# Altium project FPGA_SHIELD_MARK1.PrjPcb (part 1 of 2)
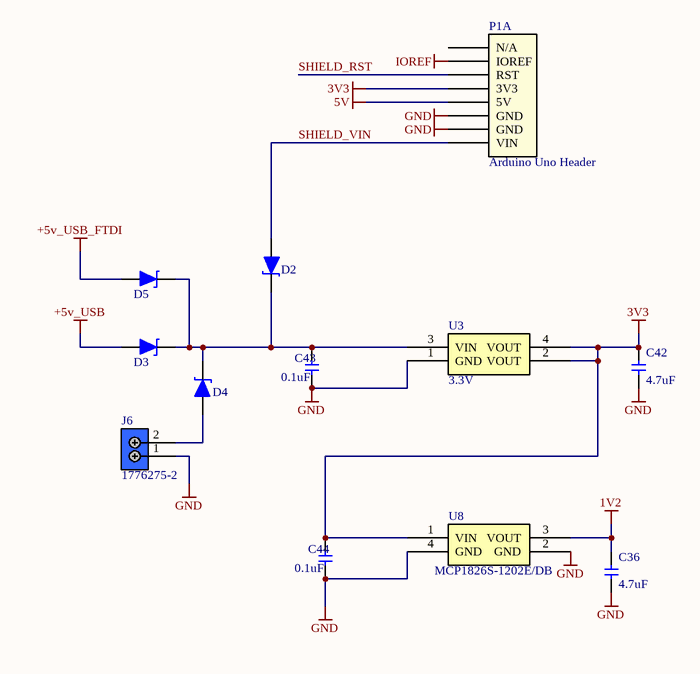
[diagram p0: POWER_SUPPLY.SchDoc]
Engineer: M. Jones; PCB_TITLE: FPGA Mark 1; PCB_VERSION: a
5 sheets, 144 parts. Net scope: flat (ports and power ports of the same name join across sheets).
Board file: FPGA_SHIELD_MARK1_Single_Side.PcbDoc
Sheets:
  POWER_SUPPLY.SchDoc
  LOGIC_FPGA.SchDoc
  FPGA_POWER_AND_CONFIGURATION.SchDoc
  DIGITAL_IO.SchDoc
  LOGIC_MCU.SchDoc

## Sheet POWER_SUPPLY.SchDoc
size B; Author: Michael Jones; Engineer: Eli Hughes; Address1: 1652 W 820 N; Address2: Provo; Address3: UT  84601; Address4: 801-379-0118; DocumentNumber: 2; Revision: A3; SheetNumber: 2; SheetTotal: 6

### Parts
(Parts that share a designator on the sheet are numbered #1, #2 ... from top to bottom, then left to right.)
C36  4.7uF  [C0603]
C42  4.7uF  [C0603]
C43#1  0.1uF  [C0603]
C44#1  0.1uF  [C0603]
D2  RB161M-20TR  [SOD-123]  (value not drawn)
D3#1  RB161M-20TR  [SOD-123]  (value not drawn)
D4  RB161M-20TR  [SOD-123]  (value not drawn)
D5  RB161M-20TR  [SOD-123]  (value not drawn)
J6#1  1776275-2  [1776275-2]
P1  Arduino Uno Header  [Arduino Shield]  (part A of 4)
U3#1  3.3V  [SOT223]
U8#1  MCP1826S-1202E/DB  [SOT223]

### Nets
1V2: C36.2 U8#1.3(VOUT)
3V3: C42.2 C44#1.2 P1.A2(3V3) U3#1.2(VOUT) U3#1.4(VOUT) U8#1.1(VIN)
5V: P1.A3(5V)
+5v_USB: D3#1.2(A)
+5v_USB_FTDI: D5.2(A)
GND: C36.1 C42.1 C43#1.1 C44#1.1 J6#1.1 P1.A4(GND) P1.A5(GND) U3#1.1(GND) U8#1.2(GND) U8#1.4(GND)
IOREF: P1.A0(IOREF)
SHIELD_RST: P1.A1(RST)
SHIELD_VIN: D2.2(A) P1.A6(VIN)
NetC43#1_2: C43#1.2 D2.1(C) D3#1.1(C) D4.1(C) D5.1(C) U3#1.3(VIN)
NetD4_2: D4.2(A) J6#1.2

Not connected (* = marked no-connect by the designer): P1 A-1(N/A)

### Notes on the sheet
- 2
- Wavenumber
- pl
- -1
- Rev:
- Technologies
- Sheet
- of

### Library data of the parts
C36 C42 = GRM188R60J475KE19D: CAP CER 4.7UF 6.3V X5R 0603; Manufacturer: Murata Electronics North America; Capacitance: 4.7µF; Tolerance: ±10%; Supplier 1: Digi-Key; Supplier Part Number 1: 490-3297-1-ND; Manufacturer Part Number: GRM188R60J475KE19D; RoHS: RoHS Compliant; Category: Capacitors; Stock 1: 714091; Pricing 1: 10=0.214, 50=0.148, 100=0.1142, 250=0.08204, 500=0.0585, 1000=0.04281 (USD); Voltage - Rated: 6.3V; Temperature Coefficient: X5R; Mounting Type: Surface Mount, MLCC; Operating Temperature: -55°C ~ 85°C; Applications: General Purpose; Ratings: -; Package / Case: 0603 (1608 Metric); Size / Dimension: 0.063" L x 0.031" W (1.60mm x 0.80mm); Height: -; Thickness: 0.035" (0.90mm); Lead Spacing: -; Features: -; Packaging: Cut Tape (CT); Lead Style: -; ComponentLink1URL: http://search.murata.co.jp/Ceramy/image/img/PDF/ENG/GRM188R60J475KE19.pdf; ComponentLink1Description: http://search.murata.co.jp/Ceramy/image/img/PDF/ENG/GRM188R60J475KE19.pdf; Value: 4.7uF
C43#1 C44#1 = GRM188R71H104KA93D: CAP CER .1UF 50V 10% X7R 0603; Manufacturer: Murata Electronics North America; Capacitance: 0.1µF; Value: 0.1uF; Supplier 1: Digi-Key; Supplier Part Number 1: 490-1519-1-ND; Manufacturer Part Number: GRM188R71H104KA93D; RoHS: RoHS Compliant; Category: Capacitors; Stock 1: 6315460; Pricing 1: 10=0.037, 100=0.0221, 500=0.01276, 1000=0.00884 (USD); Voltage - Rated: 50V; Tolerance: ±10%; Temperature Coefficient: X7R; Mounting Type: Surface Mount, MLCC; Operating Temperature: -55°C ~ 125°C; Features: -; Applications: General Purpose; Ratings: -; Package / Case: 0603 (1608 Metric); Size / Dimension: 0.063" L x 0.031" W (1.60mm x 0.80mm); Lead Spacing: -; Thickness: 0.80mm; Packaging: Cut Tape (CT); Lead Style: -; ComponentLink1URL: http://search.murata.co.jp/Ceramy/image/img/PDF/ENG/GRM188R71H104KA93.pdf; ComponentLink1Description: http://search.murata.co.jp/Ceramy/image/img/PDF/ENG/GRM188R71H104KA93.pdf
D2 D3#1 D4 D5 = RB161M-20TR: DIODE SCHOTTKY 25V 1A SOD123; Source Part Number: RB161M-20CT-ND; Manufacturer: Diodes Inc; Manufacturer Part Number: Rohm Semiconductor; Description: DIODE SCHOTTKY 20V 1A SOD123; Voltage - Forward (Vf) (Max) @ If: 350mV @ 1A; Voltage - DC Reverse (Vr) (Max): 20V; Current - Reverse Leakage @ Vr: 700µA @ 20V; Speed: Fast Recovery =< 500ns, > 200mA (Io); Source: Digikey; Value: RB161M-20TR; Supplier 1: Digi-Key; RoHS: RoHS Compliant; Category: Discrete Semiconductor Products; Stock 1: 29589; Pricing 1: 1=0.58, 25=0.4044, 100=0.3465, 250=0.29924, 500=0.25726, 1000=0.1995 (USD); Current - Average Rectified (Io): 1A; Diode Type: Schottky; Reverse Recovery Time (trr): -; Capacitance @ Vr, F: -; Mounting Type: Surface Mount; Package / Case: SOD-123F; Supplier Device Package: PMDU; Packaging: Cut Tape (CT); ComponentLink1URL: http://www.rohm.com/products/databook/di/pdf/rb161m-20.pdf; ComponentLink1Description: http://www.rohm.com/products/databook/di/pdf/rb161m-20.pdf; Supplier Part Number 1: RB161M-20CT-ND
J6#1 = 1776275-2: TERM BLOCK 2POS SIDE ENT 3.5MM; Manufacturer: TE Connectivity; Number of Levels: 1; Positions Per Level: 2; Pitch: 0.138" (3.50mm); Mating Orientation: Horizontal with Board; Current: 7A; Voltage: 250V; Wire Gauge: 18-26 AWG; Wire Termination: Screw - Leaf Spring, Wire Guard; Clamp Material - Plating: Steel, Stainless; Screw Material - Plating: Steel, Galvanized - Chromate Plated; Torque - Screw: 0.28 Nm (2.5 Lb-In); Screw Thread: M2.6; Supplier 1: Digi-Key; Supplier Part Number 1: A98036-ND; Manufacturer Part Number: 1776275-2; RoHS: RoHS Compliant; Category: Connectors, Interconnects; Stock 1: 46916; Pricing 1: 1=0.44, 10=0.417, 25=0.3572, 50=0.3036, 100=0.2917, 250=0.26196, 500=0.25004, 1000=0.20837, 2500=0.19051 (USD); Mounting Type: Through Hole; Features: Interlocking (Side); Color: Blue; Packaging: Bulk; Operating Temperature: -55°C ~ 105°C; Housing Material: Polyamide (PA66), Nylon 6/6; Contact Material - Plating: Brass - Copper Tin Plated; ComponentLink1URL: http://documents.tycoelectronics.com/commerce/DocumentDelivery/DDEController?Action=srchrtrv&DocNm=1776275&DocType=CD&DocLang=EN; ComponentLink1Description: http://documents.tycoelectronics.com/commerce/DocumentDelivery/DDEController?Action=srchrtrv&DocNm=1776275&DocType=CD&DocLang=EN; Value: 1776275-2
P1 = Arduino Shield: Arduino Duem Header
U3#1 = LD1117S33CTR: IC REG LDO 3.3V 950MA SOT-223; Manufacturer: STMicroelectronics; Regulator Topology: Positive Fixed; Voltage - Input: Up to 15V; Voltage - Dropout (Typical): 1.1V @ 800mA; Number of Regulators: 1; Supplier 1: Digi-Key; Supplier Part Number 1: 497-1241-1-ND; Manufacturer Part Number: LD1117S33CTR; RoHS: RoHS Compliant; Category: Integrated Circuits (ICs); Stock 1: 20460; Pricing 1: 1=0.54, 10=0.436, 100=0.3267, 250=0.28216, 500=0.24256, 1000=0.1881 (USD); Voltage - Output: 3.3V; Current - Output: 950mA; Current - Limit (Min): -; Operating Temperature: -40°C ~ 125°C; Mounting Type: Surface Mount; Package / Case: TO-261-4, TO-261AA; Supplier Device Package: SOT-223; Packaging: Cut Tape (CT); ComponentLink1URL: http://www.st.com/internet/com/TECHNICAL_RESOURCES/TECHNICAL_LITERATURE/DATASHEET/CD00000544.pdf; ComponentLink1Description: http://www.st.com/internet/com/TECHNICAL_RESOURCES/TECHNICAL_LITERATURE/DATASHEET/CD00000544.pdf; value: LD1117S33CTR
U8#1 = MCP1826S-1202E/DB: IC LDO REG 1A 1.2V SOT223-3; Manufacturer: Microchip Technology; Regulator Topology: Positive Fixed; Voltage - Input: Up to 6V; Voltage - Dropout (Typical): 0.25V @ 1A; Number of Regulators: 1; Current - Output: 1A (Min); Value: MCP1826S-1202E/DB; Supplier 1: Digi-Key; Supplier Part Number 1: MCP1826S-1202E/DB-ND; Manufacturer Part Number: MCP1826S-1202E/DB; RoHS: RoHS Compliant; Category: Integrated Circuits (ICs); Stock 1: 2041; Pricing 1: 1=0.74, 10=0.68, 25=0.57, 100=0.52 (USD); Voltage - Output: 1.2V; Current - Limit (Min): -; Operating Temperature: -40°C ~ 125°C; Mounting Type: Surface Mount; Package / Case: TO-261-4, TO-261AA; Supplier Device Package: SOT-223-3; Packaging: Tube; ComponentLink1URL: http://ww1.microchip.com/downloads/en/DeviceDoc/22057a.pdf; ComponentLink1Description: http://ww1.microchip.com/downloads/en/DeviceDoc/22057a.pdf

## Sheet LOGIC_FPGA.SchDoc: FPGA Logic
size B; Author: Michael Jones; Engineer: Michael Jones; Organization: Group VIII Technology; Address1: 1652 W 820 N; Address2: Provo; Address3: UT  84601; Address4: 801-379-0118; DocumentNumber: 3; Revision: A3; SheetNumber: 2; SheetTotal: 7
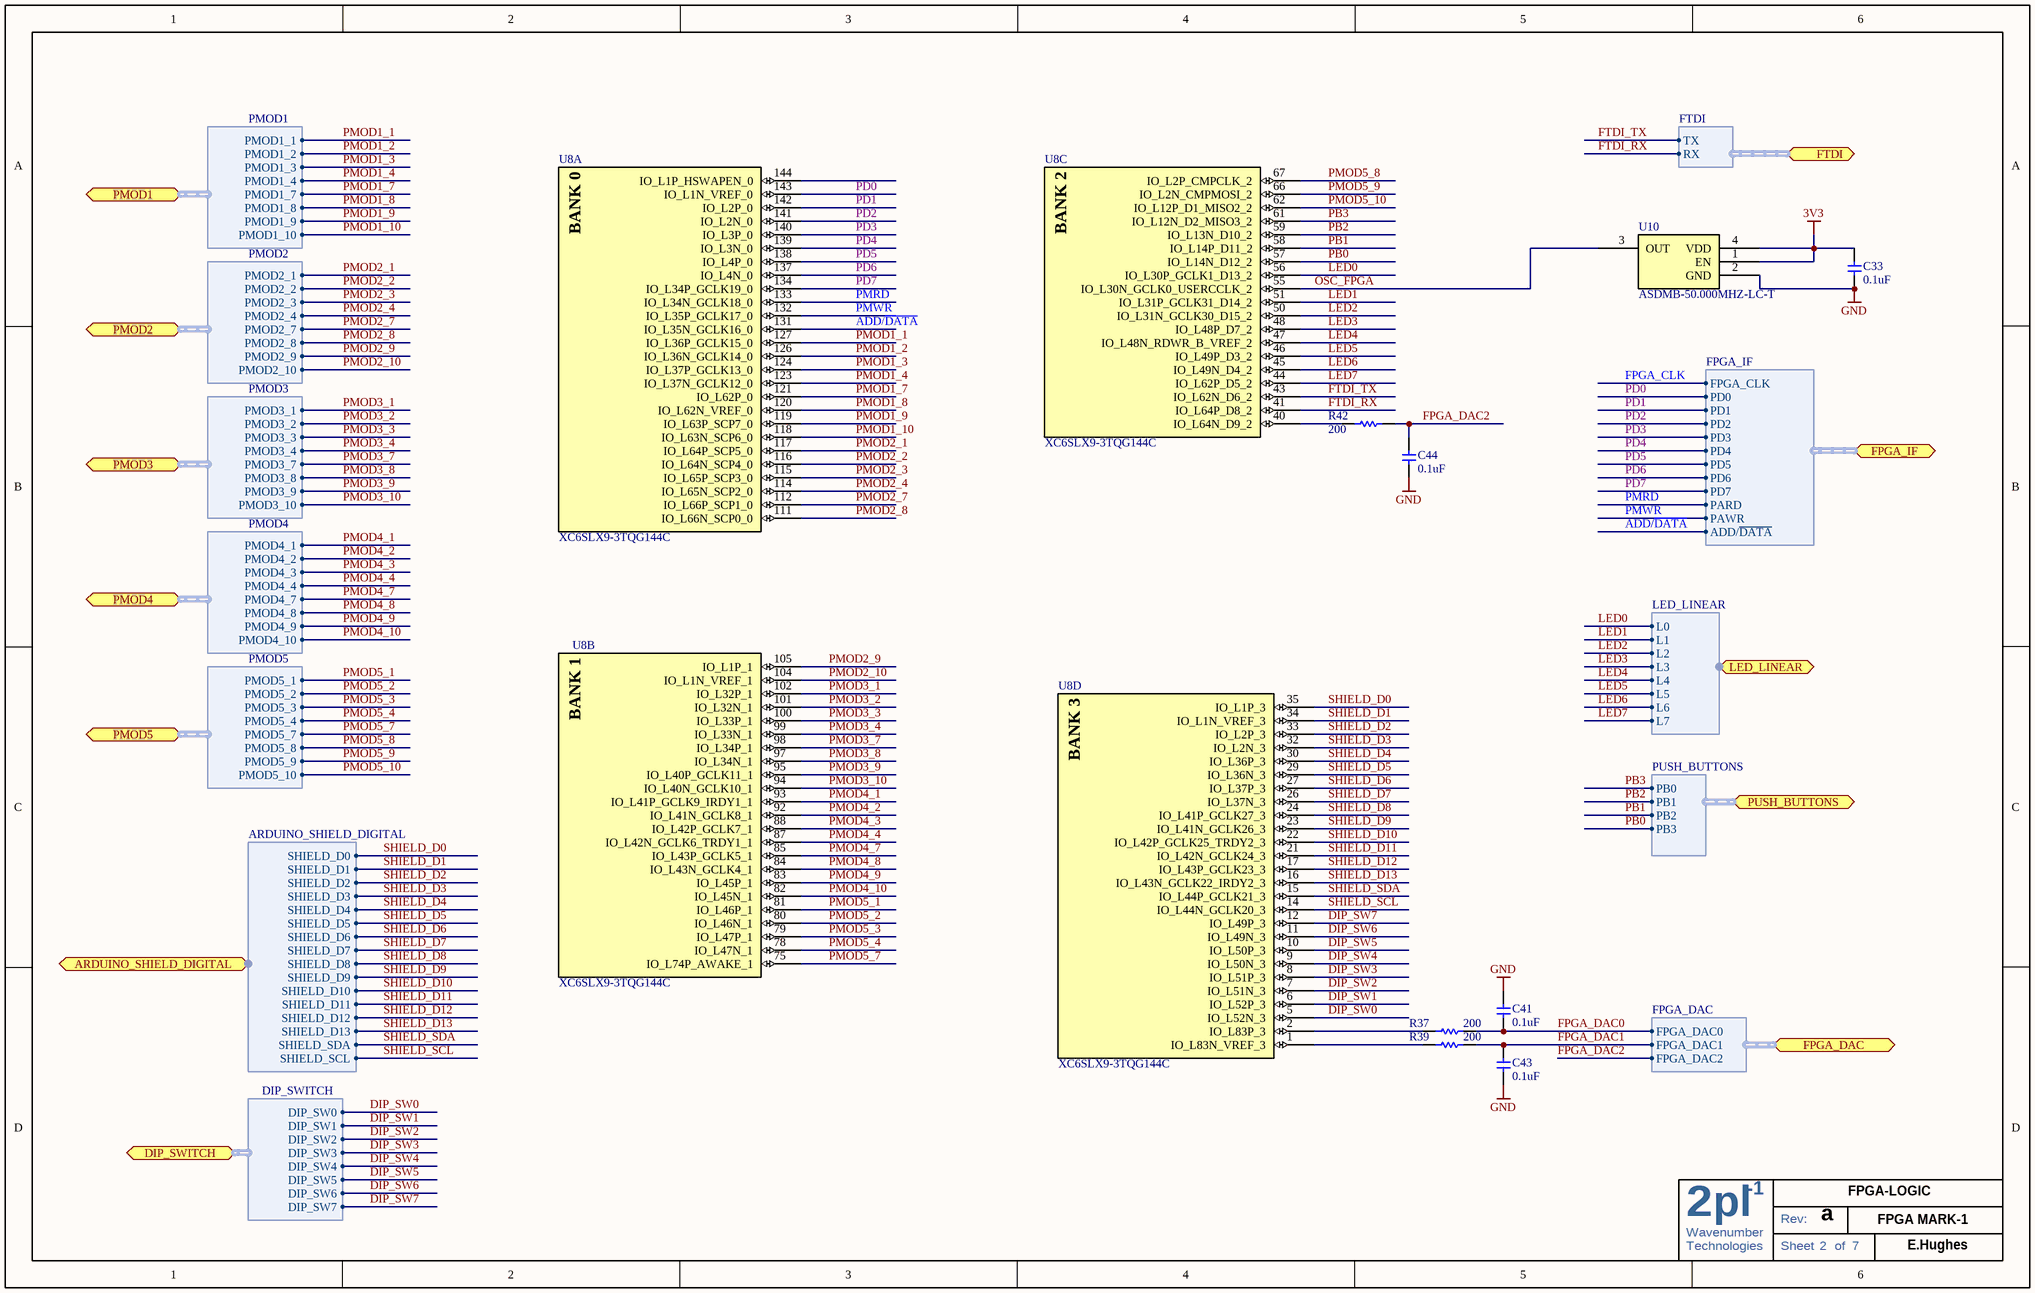
[diagram p1: LOGIC_FPGA.SchDoc]

### Parts
(Parts that share a designator on the sheet are numbered #1, #2 ... from top to bottom, then left to right.)
C33  0.1uF  [C0603]
C41  0.1uF  [C0603]
C43#2  0.1uF  [C0603]
C44#2  0.1uF  [C0603]
R37  200  [R0603]
R39  200  [R0603]
R42  200  [R0603]
U8#2  XC6SLX9-3TQG144C  [TQ144_L]  (parts A,B,C,D of 7)
U10  ASDMB-50.000MHZ-LC-T  [ASDMB - osc]

### Ports
ARDUINO_SHIELD_DIGITAL (harness ARDUINO_SHIELD_DIGITAL), DIP_SWITCH (harness DIP_SWITCH), FPGA_DAC (harness FPGA_DAC), FPGA_IF (harness FPGA_IF), FTDI (harness FTDI), LED_LINEAR (harness LED_LINEAR), PMOD1 (harness PMOD1), PMOD2 (harness PMOD2), PMOD3 (harness PMOD3), PMOD4 (harness PMOD4), PMOD5 (harness PMOD5), PUSH_BUTTONS (harness PUSH_BUTTONS)

### Harnesses
DIP_SWITCH: DIP_SW0, DIP_SW1, DIP_SW2, DIP_SW3, DIP_SW4, DIP_SW5, DIP_SW6, DIP_SW7
ARDUINO_SHIELD_DIGITAL: SHIELD_D13, SHIELD_D12, SHIELD_D11, SHIELD_D10, SHIELD_D9, SHIELD_D8, SHIELD_D7, SHIELD_D6, SHIELD_D5, SHIELD_D4, SHIELD_D3, SHIELD_D2, SHIELD_D1, SHIELD_D0, SHIELD_SDA, SHIELD_SCL
PUSH_BUTTONS: PB0, PB1, PB2, PB3
LED_LINEAR: L0, L1, L2, L3, L4, L5, L6, L7
FPGA_IF: PD0, PD1, PD2, PD3, PD4, PD5, PD6, PD7, PARD, PAWR, ADD/~{DATA}, FPGA_CLK
PMOD1: PMOD1_1, PMOD1_2, PMOD1_3, PMOD1_4, PMOD1_7, PMOD1_8, PMOD1_9, PMOD1_10
PMOD2: PMOD2_1, PMOD2_2, PMOD2_3, PMOD2_4, PMOD2_7, PMOD2_8, PMOD2_9, PMOD2_10
PMOD3: PMOD3_1, PMOD3_2, PMOD3_3, PMOD3_4, PMOD3_7, PMOD3_8, PMOD3_9, PMOD3_10
PMOD4: PMOD4_1, PMOD4_2, PMOD4_3, PMOD4_4, PMOD4_7, PMOD4_8, PMOD4_9, PMOD4_10
PMOD5: PMOD5_1, PMOD5_2, PMOD5_3, PMOD5_4, PMOD5_7, PMOD5_8, PMOD5_9, PMOD5_10
FTDI: TX, RX
FPGA_DAC: FPGA_DAC0, FPGA_DAC1, FPGA_DAC2

### Nets
3V3: C33.2 U10.1(EN) U10.4(VDD)
GND: C33.1 C41.2 C43#2.2 C44#2.2 U10.2(GND)
ADD/~{DATA}: U8#2.131(IO_L35N_GCLK16_0) ; port FPGA_IF.ADD/~{DATA}
DIP_SW0: U8#2.5(IO_L52N_3) ; port DIP_SWITCH.DIP_SW0
DIP_SW1: U8#2.6(IO_L52P_3) ; port DIP_SWITCH.DIP_SW1
DIP_SW2: U8#2.7(IO_L51N_3) ; port DIP_SWITCH.DIP_SW2
DIP_SW3: U8#2.8(IO_L51P_3) ; port DIP_SWITCH.DIP_SW3
DIP_SW4: U8#2.9(IO_L50N_3) ; port DIP_SWITCH.DIP_SW4
DIP_SW5: U8#2.10(IO_L50P_3) ; port DIP_SWITCH.DIP_SW5
DIP_SW6: U8#2.11(IO_L49N_3) ; port DIP_SWITCH.DIP_SW6
DIP_SW7: U8#2.12(IO_L49P_3) ; port DIP_SWITCH.DIP_SW7
FPGA_DAC0: C41.1 R37.1 ; port FPGA_DAC.FPGA_DAC0
FPGA_DAC1: C43#2.1 R39.1 ; port FPGA_DAC.FPGA_DAC1
FPGA_DAC2: C44#2.1 R42.1 ; port FPGA_DAC.FPGA_DAC2
FTDI_RX: U8#2.41(IO_L64P_D8_2) ; port FTDI.RX
FTDI_TX: U8#2.43(IO_L62N_D6_2) ; port FTDI.TX
LED0: U8#2.56(IO_L30P_GCLK1_D13_2) ; port LED_LINEAR.L0
LED1: U8#2.51(IO_L31P_GCLK31_D14_2) ; port LED_LINEAR.L1
LED2: U8#2.50(IO_L31N_GCLK30_D15_2) ; port LED_LINEAR.L2
LED3: U8#2.48(IO_L48P_D7_2) ; port LED_LINEAR.L3
LED4: U8#2.47(IO_L48N_RDWR_B_VREF_2) ; port LED_LINEAR.L4
LED5: U8#2.46(IO_L49P_D3_2) ; port LED_LINEAR.L5
LED6: U8#2.45(IO_L49N_D4_2) ; port LED_LINEAR.L6
LED7: U8#2.44(IO_L62P_D5_2) ; port LED_LINEAR.L7
OSC_FPGA: U8#2.55(IO_L30N_GCLK0_USERCCLK_2) U10.3(OUT)
PB0: U8#2.57(IO_L14N_D12_2) ; port PUSH_BUTTONS.PB3
PB1: U8#2.58(IO_L14P_D11_2) ; port PUSH_BUTTONS.PB2
PB2: U8#2.59(IO_L13N_D10_2) ; port PUSH_BUTTONS.PB1
PB3: U8#2.61(IO_L12N_D2_MISO3_2) ; port PUSH_BUTTONS.PB0
PD0: U8#2.143(IO_L1N_VREF_0) ; port FPGA_IF.PD0
PD1: U8#2.142(IO_L2P_0) ; port FPGA_IF.PD1
PD2: U8#2.141(IO_L2N_0) ; port FPGA_IF.PD2
PD3: U8#2.140(IO_L3P_0) ; port FPGA_IF.PD3
PD4: U8#2.139(IO_L3N_0) ; port FPGA_IF.PD4
PD5: U8#2.138(IO_L4P_0) ; port FPGA_IF.PD5
PD6: U8#2.137(IO_L4N_0) ; port FPGA_IF.PD6
PD7: U8#2.134(IO_L34P_GCLK19_0) ; port FPGA_IF.PD7
PMOD1_1: U8#2.127(IO_L36P_GCLK15_0) ; port PMOD1.PMOD1_1
PMOD1_2: U8#2.126(IO_L36N_GCLK14_0) ; port PMOD1.PMOD1_2
PMOD1_3: U8#2.124(IO_L37P_GCLK13_0) ; port PMOD1.PMOD1_3
PMOD1_4: U8#2.123(IO_L37N_GCLK12_0) ; port PMOD1.PMOD1_4
PMOD1_7: U8#2.121(IO_L62P_0) ; port PMOD1.PMOD1_7
PMOD1_8: U8#2.120(IO_L62N_VREF_0) ; port PMOD1.PMOD1_8
PMOD1_9: U8#2.119(IO_L63P_SCP7_0) ; port PMOD1.PMOD1_9
PMOD1_10: U8#2.118(IO_L63N_SCP6_0) ; port PMOD1.PMOD1_10
PMOD2_1: U8#2.117(IO_L64P_SCP5_0) ; port PMOD2.PMOD2_1
PMOD2_2: U8#2.116(IO_L64N_SCP4_0) ; port PMOD2.PMOD2_2
PMOD2_3: U8#2.115(IO_L65P_SCP3_0) ; port PMOD2.PMOD2_3
PMOD2_4: U8#2.114(IO_L65N_SCP2_0) ; port PMOD2.PMOD2_4
PMOD2_7: U8#2.112(IO_L66P_SCP1_0) ; port PMOD2.PMOD2_7
PMOD2_8: U8#2.111(IO_L66N_SCP0_0) ; port PMOD2.PMOD2_8
PMOD2_9: U8#2.105(IO_L1P_1) ; port PMOD2.PMOD2_9
PMOD2_10: U8#2.104(IO_L1N_VREF_1) ; port PMOD2.PMOD2_10
PMOD3_1: U8#2.102(IO_L32P_1) ; port PMOD3.PMOD3_1
PMOD3_2: U8#2.101(IO_L32N_1) ; port PMOD3.PMOD3_2
PMOD3_3: U8#2.100(IO_L33P_1) ; port PMOD3.PMOD3_3
PMOD3_4: U8#2.99(IO_L33N_1) ; port PMOD3.PMOD3_4
PMOD3_7: U8#2.98(IO_L34P_1) ; port PMOD3.PMOD3_7
PMOD3_8: U8#2.97(IO_L34N_1) ; port PMOD3.PMOD3_8
PMOD3_9: U8#2.95(IO_L40P_GCLK11_1) ; port PMOD3.PMOD3_9
PMOD3_10: U8#2.94(IO_L40N_GCLK10_1) ; port PMOD3.PMOD3_10
PMOD4_1: U8#2.93(IO_L41P_GCLK9_IRDY1_1) ; port PMOD4.PMOD4_1
PMOD4_2: U8#2.92(IO_L41N_GCLK8_1) ; port PMOD4.PMOD4_2
PMOD4_3: U8#2.88(IO_L42P_GCLK7_1) ; port PMOD4.PMOD4_3
PMOD4_4: U8#2.87(IO_L42N_GCLK6_TRDY1_1) ; port PMOD4.PMOD4_4
PMOD4_7: U8#2.85(IO_L43P_GCLK5_1) ; port PMOD4.PMOD4_7
PMOD4_8: U8#2.84(IO_L43N_GCLK4_1) ; port PMOD4.PMOD4_8
PMOD4_9: U8#2.83(IO_L45P_1) ; port PMOD4.PMOD4_9
PMOD4_10: U8#2.82(IO_L45N_1) ; port PMOD4.PMOD4_10
PMOD5_1: U8#2.81(IO_L46P_1) ; port PMOD5.PMOD5_1
PMOD5_2: U8#2.80(IO_L46N_1) ; port PMOD5.PMOD5_2
PMOD5_3: U8#2.79(IO_L47P_1) ; port PMOD5.PMOD5_3
PMOD5_4: U8#2.78(IO_L47N_1) ; port PMOD5.PMOD5_4
PMOD5_7: U8#2.75(IO_L74P_AWAKE_1) ; port PMOD5.PMOD5_7
PMOD5_8: U8#2.67(IO_L2P_CMPCLK_2) ; port PMOD5.PMOD5_8
PMOD5_9: U8#2.66(IO_L2N_CMPMOSI_2) ; port PMOD5.PMOD5_9
PMOD5_10: U8#2.62(IO_L12P_D1_MISO2_2) ; port PMOD5.PMOD5_10
PMRD: U8#2.133(IO_L34N_GCLK18_0) ; port FPGA_IF.PARD  [project net PARD]
PMWR: U8#2.132(IO_L35P_GCLK17_0) ; port FPGA_IF.PAWR  [project net PAWR]
SHIELD_D0: U8#2.35(IO_L1P_3) ; port ARDUINO_SHIELD_DIGITAL.SHIELD_D0
SHIELD_D1: U8#2.34(IO_L1N_VREF_3) ; port ARDUINO_SHIELD_DIGITAL.SHIELD_D1
SHIELD_D2: U8#2.33(IO_L2P_3) ; port ARDUINO_SHIELD_DIGITAL.SHIELD_D2
SHIELD_D3: U8#2.32(IO_L2N_3) ; port ARDUINO_SHIELD_DIGITAL.SHIELD_D3
SHIELD_D4: U8#2.30(IO_L36P_3) ; port ARDUINO_SHIELD_DIGITAL.SHIELD_D4
SHIELD_D5: U8#2.29(IO_L36N_3) ; port ARDUINO_SHIELD_DIGITAL.SHIELD_D5
SHIELD_D6: U8#2.27(IO_L37P_3) ; port ARDUINO_SHIELD_DIGITAL.SHIELD_D6
SHIELD_D7: U8#2.26(IO_L37N_3) ; port ARDUINO_SHIELD_DIGITAL.SHIELD_D7
SHIELD_D8: U8#2.24(IO_L41P_GCLK27_3) ; port ARDUINO_SHIELD_DIGITAL.SHIELD_D8
SHIELD_D9: U8#2.23(IO_L41N_GCLK26_3) ; port ARDUINO_SHIELD_DIGITAL.SHIELD_D9
SHIELD_D10: U8#2.22(IO_L42P_GCLK25_TRDY2_3) ; port ARDUINO_SHIELD_DIGITAL.SHIELD_D10
SHIELD_D11: U8#2.21(IO_L42N_GCLK24_3) ; port ARDUINO_SHIELD_DIGITAL.SHIELD_D11
SHIELD_D12: U8#2.17(IO_L43P_GCLK23_3) ; port ARDUINO_SHIELD_DIGITAL.SHIELD_D12
SHIELD_D13: U8#2.16(IO_L43N_GCLK22_IRDY2_3) ; port ARDUINO_SHIELD_DIGITAL.SHIELD_D13
SHIELD_SCL: U8#2.14(IO_L44N_GCLK20_3) ; port ARDUINO_SHIELD_DIGITAL.SHIELD_SCL
SHIELD_SDA: U8#2.15(IO_L44P_GCLK21_3) ; port ARDUINO_SHIELD_DIGITAL.SHIELD_SDA
NetR37_2: R37.2 U8#2.2(IO_L83P_3)
NetR39_2: R39.2 U8#2.1(IO_L83N_VREF_3)
NetR42_2: R42.2 U8#2.40(IO_L64N_D9_2)

Not connected (* = marked no-connect by the designer): U8#2 144(IO_L1P_HSWAPEN_0)

### Notes on the sheet
- a
- FPGA-LOGIC
- FPGA MARK-1
- E.Hughes
- 2
- Wavenumber
- pl
- -1
- Rev:
- Technologies
- Sheet
- of
- (in symbol XC6SLX9-3TQG144C, part A) BANK 0
- (in symbol XC6SLX9-3TQG144C, part B) BANK 1
- (in symbol XC6SLX9-3TQG144C, part C) BANK 2
- (in symbol XC6SLX9-3TQG144C, part D) BANK 3

### Library data of the parts
C33 C41 C43#2 C44#2 = GRM188R71H104KA93D: as C43#1 on sheet POWER_SUPPLY; Manufacturer Part Number: GRM188R71H104KA93D; Supplier 1: Digi-Key; Supplier Part Number 1: 490-1519-1-ND; RoHS: RoHS Compliant; Category: Capacitors; Pricing 1: 10=0.037, 100=0.0221, 500=0.01276, 1000=0.00884 (USD); Voltage - Rated: 50V; Tolerance: ±10%; Temperature Coefficient: X7R; Mounting Type: Surface Mount, MLCC; Operating Temperature: -55°C ~ 125°C; Features: -; Applications: General Purpose; Ratings: -; Package / Case: 0603 (1608 Metric); Size / Dimension: 0.063" L x 0.031" W (1.60mm x 0.80mm); Lead Spacing: -; Thickness: 0.80mm; Packaging: Cut Tape (CT); Lead Style: -; ComponentLink1URL: http://search.murata.co.jp/Ceramy/image/img/PDF/ENG/GRM188R71H104KA93.pdf; ComponentLink1Description: http://search.murata.co.jp/Ceramy/image/img/PDF/ENG/GRM188R71H104KA93.pdf
  C33: Value: CAP CER .1UF 50V 10% X7R 0603; Stock 1: 9370695
  C41 C43#2 C44#2: Value: 0.1uF; Stock 1: 6315460
R37 R39 R42 = ERJ-3EKF2000V: RES 200 OHM 1/10W 1% 0603 SMD; Manufacturer: Panasonic - ECG; Power (Watts): 0.1W, 1/10W; Temperature Coefficient: ±100ppm/°C; Value: RES 200 OHM 1/10W 1% 0603 SMD; Supplier 1: Digi-Key; Supplier Part Number 1: P200HCT-ND; Manufacturer Part Number: ERJ-3EKF2000V; RoHS: RoHS Compliant; Category: Resistors; Stock 1: 1279595; Pricing 1: 1=0.04, 50=0.015, 100=0.0114, 250=0.00844, 500=0.00624, 1000=0.00416 (USD); Resistance (Ohms): 200; Composition: Thick Film; Features: -; Tolerance: ±1%; Size / Dimension: 0.063" L x 0.031" W (1.60mm x 0.80mm); Height: 0.018" (0.45mm); Lead Style: Surface Mount (SMD - SMT); Packaging: Cut Tape (CT); Package / Case: 0603 (1608 Metric); ComponentLink1URL: http://industrial.panasonic.com/www-cgi/jvcr13pz.cgi?E+PZ+3+AOA0002+ERJ3EKF2000V+7+WW; ComponentLink1Description: http://industrial.panasonic.com/www-cgi/jvcr13pz.cgi?E+PZ+3+AOA0002+ERJ3EKF2000V+7+WW
U8#2 = XC6SLX9-3TQG144C: IC FPAG SPARTAN 6 9K 144TQFP; Manufacturer: Xilinx Inc; Number of Logic Elements/Cells: 9152; Number of LABs/CLBs: 715; Total RAM Bits: 589824; Number of I /O: 102; Voltage - Supply: 1.14 V ~ 1.26 V; Supplier 1: Digi-Key; Supplier Part Number 1: 122-1747-ND; Manufacturer Part Number: XC6SLX9-3TQG144C; RoHS: RoHS Compliant; Category: Integrated Circuits (ICs); Stock 1: 77; Pricing 1: 1=17.22 (USD); Number of Gates: -; Mounting Type: Surface Mount; Operating Temperature: 0°C ~ 85°C; Package / Case: 144-LQFP; Supplier Device Package: 144-TQFP (20x20); ComponentLink1URL: http://www.xilinx.com/support/documentation/data_sheets/ds160.pdf; ComponentLink1Description: http://www.xilinx.com/support/documentation/data_sheets/ds160.pdf; Value: XC6SLX9-3TQG144C
U10 = ASDMB-50.000MHZ-LC-T: OSC MEMS 50.000 MHZ SMD; Manufacturer: Abracon Corporation; Frequency: 50MHz; Function: Tri-State (Output Enable); Output: CMOS; Voltage - Supply: 1.8 V ~ 3.3 V; Frequency Stability: ±50ppm; Current - Supply (Max): 16mA; Current - Supply (Disable) (Max): 15µA; Supplier 1: Digi-Key; Manufacturer Part Number: ASDMB-50.000MHZ-LC-T; RoHS: RoHS Compliant; Category: Crystals and Oscillators; Stock 1: 967; Pricing 1: 1=1.69, 10=1.463, 50=1.2826, 100=1.0125, 500=0.855 (USD); Type: MEMS (Silicon); Operating Temperature: -40°C ~ 85°C; Mounting Type: Surface Mount; Size / Dimension: 0.098" L x 0.079" W (2.50mm x 2.00mm); Height: 0.035" (0.90mm); Package / Case: 4-SMD, No Lead (DFN, LCC); Packaging: Cut Tape (CT); ComponentLink1URL: http://www.abracon.com/Oscillators/ASDMB.pdf; ComponentLink1Description: http://www.abracon.com/Oscillators/ASDMB.pdf; Supplier Part Number 1: 535-11738-1-ND; Value: ASDMB-50.000MHZ-LC-T

## Sheet FPGA_POWER_AND_CONFIGURATION.SchDoc: FPGA Power and Configuration
size B; Author: Michael Jones; Engineer: Michael Jones; Organization: Group VIII Technology; Address1: 1652 W 820 N; Address2: Provo; Address3: UT  84601; Address4: 801-379-0118; DocumentNumber: 4; Revision: A3; SheetNumber: 4; SheetTotal: 6
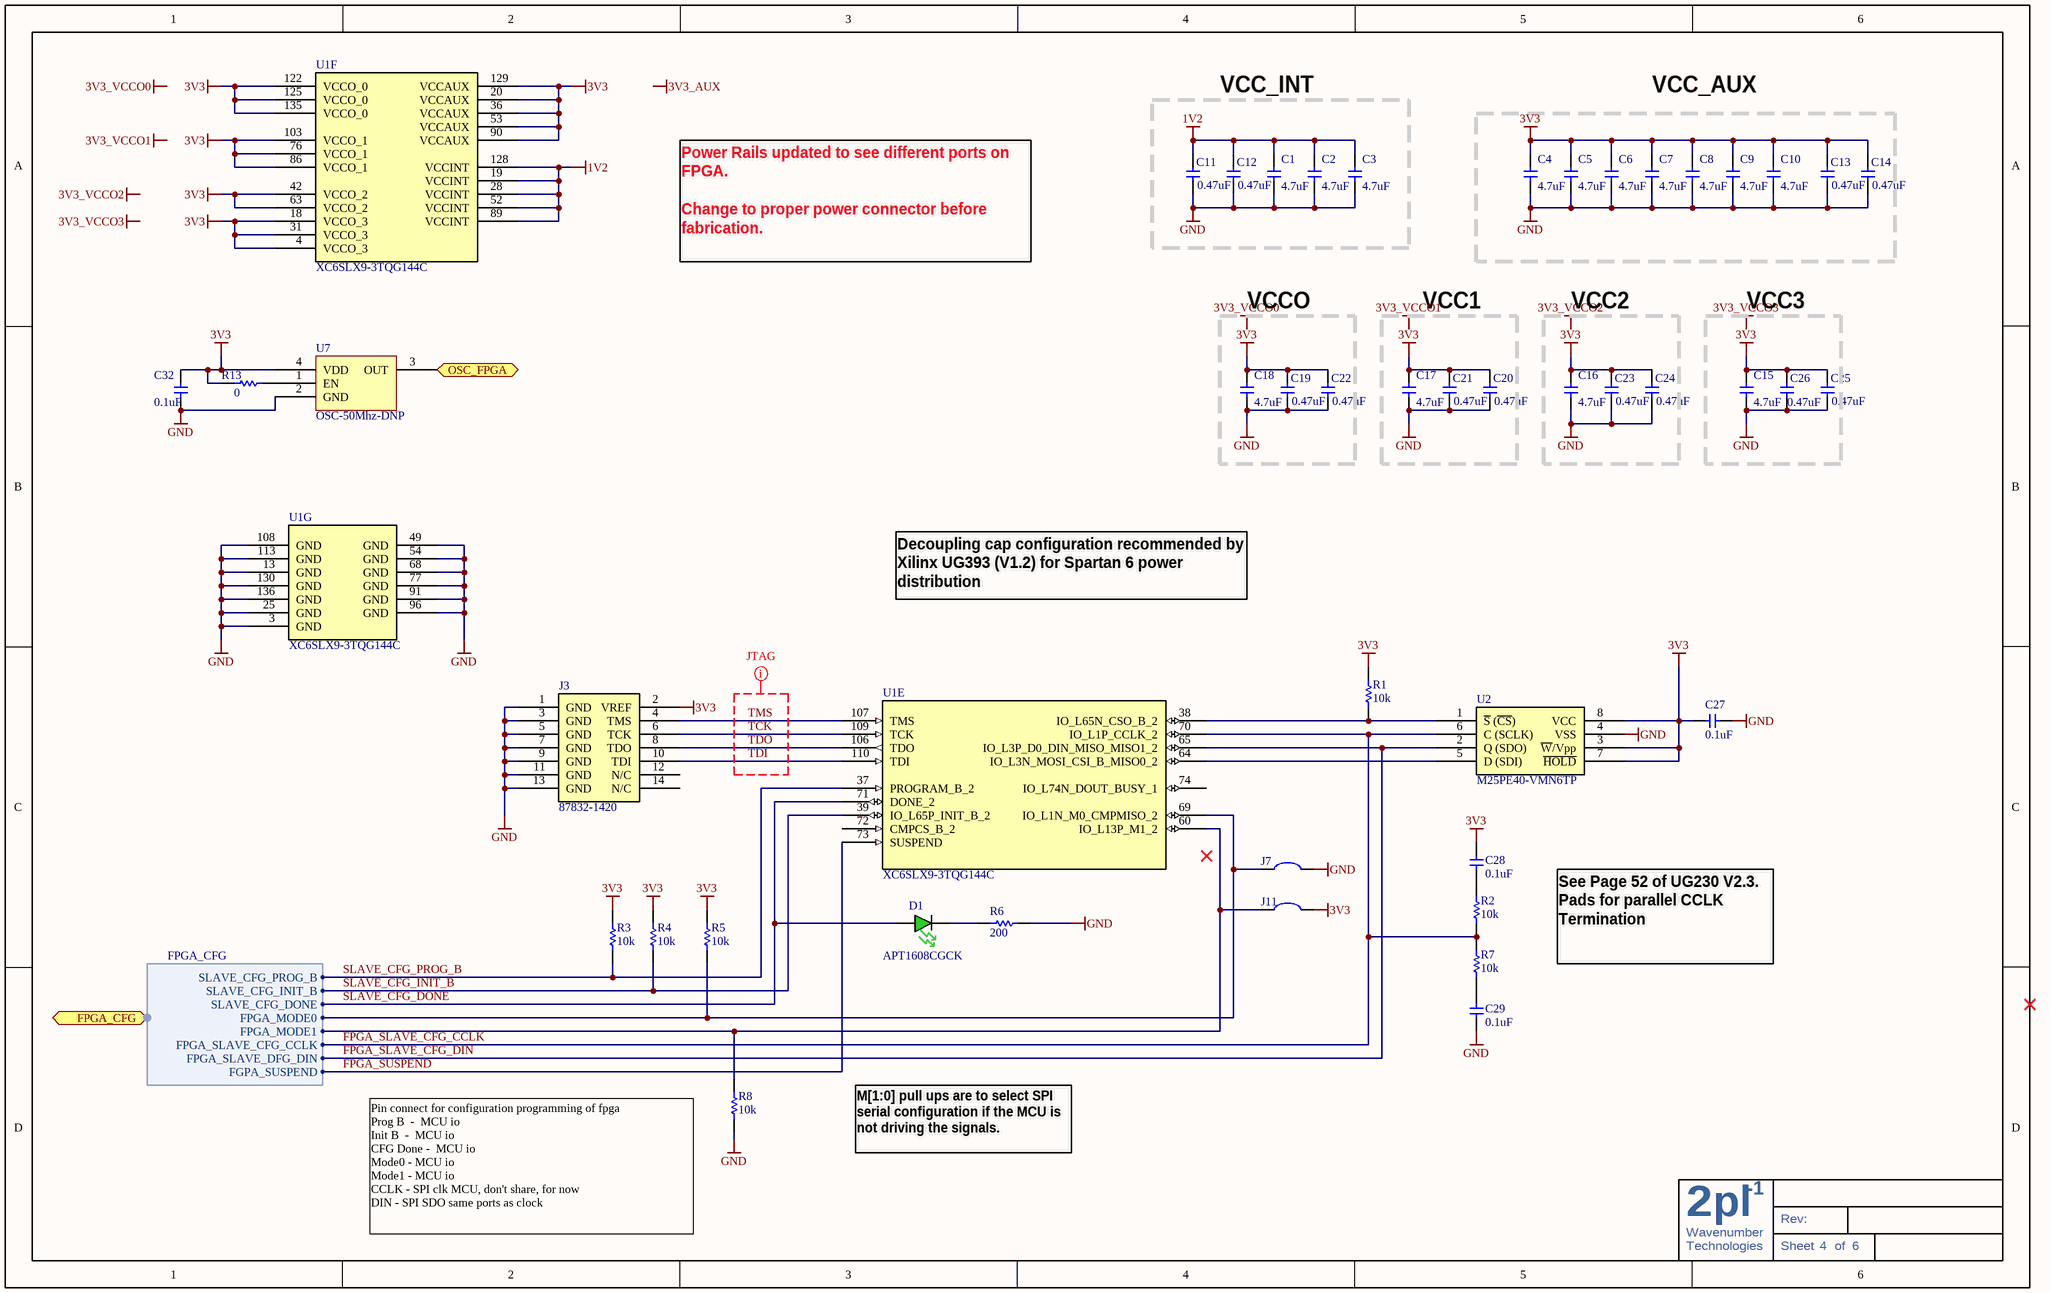
[diagram p2: FPGA_POWER_AND_CONFIGURATION.SchDoc]

### Parts
(Parts that share a designator on the sheet are numbered #1, #2 ... from top to bottom, then left to right.)
C1#1  4.7uF  [C0603]
C2#1  4.7uF  [C0603]
C3  4.7uF  [C0603]
C4  4.7uF  [C0603]
C5  4.7uF  [C0603]
C6  4.7uF  [C0603]
C7#1  4.7uF  [C0603]
C8#1  4.7uF  [C0603]
C9#1  4.7uF  [C0603]
C10#1  4.7uF  [C0603]
C11#1  0.47uF  [C0603]
C12  0.47uF  [C0603]
C13  0.47uF  [C0603]
C14  0.47uF  [C0603]
C15  4.7uF  [C0603]
C16  4.7uF  [C0603]
C17  4.7uF  [C0603]
C18  4.7uF  [C0603]
C19  0.47uF  [C0603]
C20  0.47uF  [C0603]
C21  0.47uF  [C0603]
C22  0.47uF  [C0603]
C23  0.47uF  [C0603]
C24  0.47uF  [C0603]
C25  0.47uF  [C0603]
C26  0.47uF  [C0603]
C27  0.1uF  [C0603]
C28  0.1uF  [C0603]
C29#1  0.1uF  [C0603]
C32#1  0.1uF  [C0603]
D1  APT1608CGCK  [LED_0603 - GREEN]
J3#1  87832-1420  [87832-1420]
J7  Solder Jumper  [SOLDER_JUMPER]  (value not drawn)
J11  Solder Jumper  [SOLDER_JUMPER]  (value not drawn)
R1#1  10k  [R0603]
R2#1  10k  [R0603]
R3#1  10k  [R0603]
R4#1  10k  [R0603]
R5#1  10k  [R0603]
R6#1  200  [R0603]
R7#1  10k  [R0603]
R8#1  10k  [R0603]
R13#1  0  [R0603]
U1#1  XC6SLX9-3TQG144C  [TQ144_L]  (parts E,F,G of 7)
U2  M25PE40-VMN6TP  [SOIC 8]
U7  OSC-50Mhz-DNP  [ASDMB - osc]

### Blocks framed on the sheet
VCC_INT: C1#1 C2#1 C3 C11#1 C12
VCC_AUX: C4-C6 C7#1 C8#1 C9#1 C10#1 C13 C14
VCCO: C18 C19 C22
VCC1: C17 C20 C21
VCC2: C16 C23 C24
VCC3: C15 C25 C26

### Ports
FPGA_CFG (harness FPGA_CFG), OSC_FPGA (out)

### Harnesses
FPGA_CFG: SLAVE_CFG_PROG_B, SLAVE_CFG_INIT_B, SLAVE_CFG_DONE, FPGA_MODE0, FPGA_MODE1, FPGA_SLAVE_CFG_CCLK, FPGA_SLAVE_DFG_DIN, FGPA_SUSPEND

### Nets
1V2: C1#1.2 C2#1.2 C3.2 C11#1.2 C12.2 U1#1.19(VCCINT) U1#1.28(VCCINT) U1#1.52(VCCINT) U1#1.89(VCCINT) U1#1.128(VCCINT)
3V3: C4.2 C5.2 C6.2 C7#1.2 C8#1.2 C9#1.2 C10#1.2 C13.2 C14.2 C15.2 C16.2 C17.2 C18.2 C19.2 C20.2 C21.2 C22.2 C23.2 C24.2 C25.2 C26.2 C27.1 C28.2 C32#1.2 J3#1.2(VREF) J11.2 R1#1.2 R3#1.2 R4#1.2 R5#1.2 R13#1.2 U1#1.4(VCCO_3) U1#1.18(VCCO_3) U1#1.20(VCCAUX) U1#1.31(VCCO_3) U1#1.36(VCCAUX) U1#1.42(VCCO_2) U1#1.53(VCCAUX) U1#1.63(VCCO_2) U1#1.76(VCCO_1) U1#1.86(VCCO_1) U1#1.90(VCCAUX) U1#1.103(VCCO_1) U1#1.122(VCCO_0) U1#1.125(VCCO_0) U1#1.129(VCCAUX) U1#1.135(VCCO_0) U2.3(~{W}/Vpp) U2.7(~{HOLD}) U2.8(VCC) U7.4(VDD)
GND: C1#1.1 C2#1.1 C3.1 C4.1 C5.1 C6.1 C7#1.1 C8#1.1 C9#1.1 C10#1.1 C11#1.1 C12.1 C13.1 C14.1 C15.1 C16.1 C17.1 C18.1 C19.1 C20.1 C21.1 C22.1 C23.1 C24.1 C25.1 C26.1 C27.2 C29#1.1 C32#1.1 J3#1.1(GND) J3#1.3(GND) J3#1.5(GND) J3#1.7(GND) J3#1.9(GND) J3#1.11(GND) J3#1.13(GND) J7.2 R6#1.2 R8#1.1 U1#1.3(GND) U1#1.13(GND) U1#1.25(GND) U1#1.49(GND) U1#1.54(GND) U1#1.68(GND) U1#1.77(GND) U1#1.91(GND) U1#1.96(GND) U1#1.108(GND) U1#1.113(GND) U1#1.130(GND) U1#1.136(GND) U2.4(VSS) U7.2(GND)
FPGA_MODE0: J7.1 R5#1.1 U1#1.69(IO_L1N_M0_CMPMISO_2) ; port FPGA_CFG.FPGA_MODE0
FPGA_MODE1: J11.1 R8#1.2 U1#1.60(IO_L13P_M1_2) ; port FPGA_CFG.FPGA_MODE1
FPGA_SLAVE_CFG_CCLK: R2#1.1 R7#1.2 U1#1.70(IO_L1P_CCLK_2) U2.6(C_(SCLK)) ; port FPGA_CFG.FPGA_SLAVE_CFG_CCLK
FPGA_SLAVE_CFG_DIN: U1#1.65(IO_L3P_D0_DIN_MISO_MISO1_2) U2.2(Q_(SDO)) ; port FPGA_CFG.FPGA_SLAVE_DFG_DIN
FPGA_SUSPEND: U1#1.73(SUSPEND) ; port FPGA_CFG.FGPA_SUSPEND
SLAVE_CFG_DONE: D1.A U1#1.71(DONE_2) ; port FPGA_CFG.SLAVE_CFG_DONE
SLAVE_CFG_INIT_B: R4#1.1 U1#1.39(IO_L65P_INIT_B_2) ; port FPGA_CFG.SLAVE_CFG_INIT_B
SLAVE_CFG_PROG_B: R3#1.1 U1#1.37(PROGRAM_B_2) ; port FPGA_CFG.SLAVE_CFG_PROG_B
TCK: J3#1.6(TCK) U1#1.109(TCK)
TDI: J3#1.10(TDI) U1#1.110(TDI)
TDO: J3#1.8(TDO) U1#1.106(TDO)
TMS: J3#1.4(TMS) U1#1.107(TMS)
NetC28_1: C28.1 R2#1.2
NetC29#1_2: C29#1.2 R7#1.1
NetD1_C: D1.C R6#1.1
NetR1#1_1: R1#1.1 U1#1.38(IO_L65N_CSO_B_2) U2.1(~{S}_(~{CS}))
NetR13#1_1: R13#1.1 U7.1(EN)
NetU1#1_64: U1#1.64(IO_L3N_MOSI_CSI_B_MISO0_2) U2.5(D_(SDI))
NetU7_3: U7.3(OUT) ; port OSC_FPGA

Not connected (* = marked no-connect by the designer): J3#1 12(N/C) 14(N/C); U1#1 72(CMPCS_B_2) 74(IO_L74N_DOUT_BUSY_1)

### Layout directives
net class JTAG: TCK, TDI, TDO, TMS

### Notes on the sheet
- Power Rails updated to see different ports on FPGA.
  Change to proper power connector before fabrication.
- Decoupling cap configuration recommended by Xilinx UG393 (V1.2) for Spartan 6 power distribution
- See Page 52 of UG230 V2.3.   Pads for parallel CCLK Termination
- M[1:0] pull ups are to select SPI serial configuration if the MCU is not driving the signals.
- (near R8#1) Pin connect for configuration programming of fpga
  Prog B 	- 	MCU io
  Init B 	- 	MCU io
  CFG Done - 	MCU io
  Mode0	-	MCU io
  Mode1	-	MCU io
  CCLK	-	SPI clk MCU, don't share, for now
  DIN	-	SPI SDO same ports as clock
- Labels drawn without touching a wire or pin: 3V3_AUX, 3V3_VCCO0, 3V3_VCCO1, 3V3_VCCO2, 3V3_VCCO3
- 2
- Wavenumber
- pl
- -1
- Rev:
- Technologies
- Sheet
- of

### Library data of the parts
C1#1 C2#1 C3-C6 C7#1 C8#1 C9#1 C10#1 C15-C18 = GRM188R60J475KE19D: as C36 on sheet POWER_SUPPLY; Supplier 1: Digi-Key; Supplier Part Number 1: 490-3297-1-ND; Manufacturer Part Number: GRM188R60J475KE19D; RoHS: RoHS Compliant; Category: Capacitors; Stock 1: 714091; Pricing 1: 10=0.214, 50=0.148, 100=0.1142, 250=0.08204, 500=0.0585, 1000=0.04281 (USD); Voltage - Rated: 6.3V; Temperature Coefficient: X5R; Mounting Type: Surface Mount, MLCC; Operating Temperature: -55°C ~ 85°C; Applications: General Purpose; Ratings: -; Package / Case: 0603 (1608 Metric); Size / Dimension: 0.063" L x 0.031" W (1.60mm x 0.80mm); Height: -; Thickness: 0.035" (0.90mm); Lead Spacing: -; Features: -; Packaging: Cut Tape (CT); Lead Style: -; ComponentLink1URL: http://search.murata.co.jp/Ceramy/image/img/PDF/ENG/GRM188R60J475KE19.pdf; ComponentLink1Description: http://search.murata.co.jp/Ceramy/image/img/PDF/ENG/GRM188R60J475KE19.pdf; Value: 4.7uF
C11#1 C12-C14 C19-C26 = GCM188R71E474KA64D: CAP CER .47UF 25V X7R 0603; Manufacturer: Murata Electronics North America; Capacitance: 0.47µF; Tolerance: ±10%; Supplier 1: Digi-Key; Supplier Part Number 1: 490-4776-1-ND; Manufacturer Part Number: GCM188R71E474KA64D; RoHS: RoHS Compliant; Category: Capacitors; Stock 1: 120782; Pricing 1: 10=0.248, 50=0.1444, 100=0.1155, 250=0.08252, 500=0.0561, 1000=0.04538 (USD); Voltage - Rated: 25V; Temperature Coefficient: X7R; Mounting Type: Surface Mount, MLCC; Operating Temperature: -55°C ~ 125°C; Applications: Automotive; Ratings: AEC-Q200; Package / Case: 0603 (1608 Metric); Size / Dimension: 0.063" L x 0.031" W (1.60mm x 0.80mm); Height: -; Thickness: 0.035" (0.90mm); Lead Spacing: -; Features: -; Packaging: Cut Tape (CT); Lead Style: -; ComponentLink1URL: http://search.murata.co.jp/Ceramy/image/img/PDF/ENG/GCM188R71E474KA64.pdf; ComponentLink1Description: http://search.murata.co.jp/Ceramy/image/img/PDF/ENG/GCM188R71E474KA64.pdf; Value: 0.47uF
C27 C28 C29#1 C32#1 = GRM188R71H104KA93D: as C43#1 on sheet POWER_SUPPLY; Manufacturer Part Number: GRM188R71H104KA93D; Value: CAP CER .1UF 50V 10% X7R 0603; Supplier 1: Digi-Key; Supplier Part Number 1: 490-1519-1-ND; RoHS: RoHS Compliant; Category: Capacitors; Stock 1: 9370695; Pricing 1: 10=0.037, 100=0.0221, 500=0.01276, 1000=0.00884 (USD); Voltage - Rated: 50V; Tolerance: ±10%; Temperature Coefficient: X7R; Mounting Type: Surface Mount, MLCC; Operating Temperature: -55°C ~ 125°C; Features: -; Applications: General Purpose; Ratings: -; Package / Case: 0603 (1608 Metric); Size / Dimension: 0.063" L x 0.031" W (1.60mm x 0.80mm); Lead Spacing: -; Thickness: 0.80mm; Packaging: Cut Tape (CT); Lead Style: -; ComponentLink1URL: http://search.murata.co.jp/Ceramy/image/img/PDF/ENG/GRM188R71H104KA93.pdf; ComponentLink1Description: http://search.murata.co.jp/Ceramy/image/img/PDF/ENG/GRM188R71H104KA93.pdf
D1 = APT1608CGCK: LED 1.6X0.8MM 570NM GRN CLR SMD; Manufacturer: Kingbright Corp; Color: Green; Current - Test: 20mA; Wavelength - Peak: 574nm; Millicandela Rating: 50mcd; Voltage - Forward (Vf) Typ: 2.1V; Lens Type: Clear; Lens Style/Size: Rectangle, 1.2mm x 0.8mm; Viewing Angle: 120°; Value: APT1608CGCK; Supplier 1: Digi-Key; Supplier Part Number 1: 754-1116-2-ND; Manufacturer Part Number: APT1608CGCK; RoHS: RoHS Compliant; Category: Optoelectronics; Stock 1: 94000; Pricing 1: 2000=0.051, 6000=0.045, 10000=0.043 (USD); Luminous Flux @ Current - Test: -; Wavelength - Dominant: 570nm; Size / Dimension: 1.60mm L x 0.80mm W; Height: 0.75mm; Package / Case: 0603 (1608 Metric); Mounting Type: Surface Mount; Packaging: Tape & Reel (TR); ComponentLink1URL: http://www.us.kingbright.com/images/catalog/SPEC/APT1608CGCK.pdf; ComponentLink1Description: http://www.us.kingbright.com/images/catalog/SPEC/APT1608CGCK.pdf
J3#1 = XILINX_JTAG: CONN HEADER 14POS 2MM VERT SMD; Manufacturer: Molex Connector Corporation; Source Part Number: WM18641-ND; Manufacturer Part Number: 87832-1420; Source: Digikey; Value: CONN HEADER 14POS 2MM VERT SMD; ROHS Certificate: *
J7 J11 = Solder Jumper: Solder/Configuration Jumper; Manufacturer: n/a; Manufacturer Part Number: n/a; Source: n/a; Source Part Number: n/a; ROHS Certificate: n/a
R1#1 R2#1 R3#1 R4#1 R5#1 R7#1 R8#1 = ERJ-3EKF1002V: RES 10.0K OHM 1/10W 1% 0603 SMD; Manufacturer: Panasonic - ECG; Power (Watts): 0.1W, 1/10W; Temperature Coefficient: ±100ppm/°C; Manufacturer Part Number: ERJ-3EKF1002V; Value: 10k; Supplier 1: Digi-Key; RoHS: RoHS Compliant; Category: Resistors; Stock 1: 11168880; Pricing 1: 1=0.04, 50=0.015, 100=0.0114, 250=0.00844, 500=0.00624, 1000=0.00416 (USD); Resistance (Ohms): 10.0K; Composition: Thick Film; Features: -; Tolerance: ±1%; Size / Dimension: 0.063" L x 0.031" W (1.60mm x 0.80mm); Height: 0.018" (0.45mm); Lead Style: Surface Mount (SMD - SMT); Packaging: Cut Tape (CT); Package / Case: 0603 (1608 Metric); ComponentLink1URL: http://industrial.panasonic.com/www-cgi/jvcr13pz.cgi?E+PZ+3+AOA0002+ERJ3EKF1002V+7+WW; ComponentLink1Description: http://industrial.panasonic.com/www-cgi/jvcr13pz.cgi?E+PZ+3+AOA0002+ERJ3EKF1002V+7+WW; Supplier Part Number 1: P10.0KHCT-ND
R6#1 = ERJ-3EKF2000V: as R37 on sheet LOGIC_FPGA; Manufacturer Part Number: ERJ-3EKF2000V; Value: RES 200 OHM 1/10W 1% 0603 SMD; Supplier 1: Digi-Key; Supplier Part Number 1: P200HCT-ND; RoHS: RoHS Compliant; Category: Resistors; Stock 1: 1279595; Pricing 1: 1=0.04, 50=0.015, 100=0.0114, 250=0.00844, 500=0.00624, 1000=0.00416 (USD); Resistance (Ohms): 200; Composition: Thick Film; Features: -; Tolerance: ±1%; Size / Dimension: 0.063" L x 0.031" W (1.60mm x 0.80mm); Height: 0.018" (0.45mm); Lead Style: Surface Mount (SMD - SMT); Packaging: Cut Tape (CT); Package / Case: 0603 (1608 Metric); ComponentLink1URL: http://industrial.panasonic.com/www-cgi/jvcr13pz.cgi?E+PZ+3+AOA0002+ERJ3EKF2000V+7+WW; ComponentLink1Description: http://industrial.panasonic.com/www-cgi/jvcr13pz.cgi?E+PZ+3+AOA0002+ERJ3EKF2000V+7+WW
R13#1 = ERJ-3GEY0R00V: RES ZERO OHM 1/10W 5% 0603 SMD; Manufacturer: Panasonic - ECG; Description: RES 0.0 OHM 1/10W 0603 SMD; Resistance (Ohms): 0.0; Power (Watts): 0.1W, 1/10W; Temperature Coefficient: -100/ +600ppm/°C; Tolerance: Jumper; Manufacturer Part Number: ERJ-3GEY0R00V; Value: 0; Supplier 1: Digi-Key; RoHS: RoHS Compliant; Category: Resistors; Stock 1: 28391645; Pricing 1: 1=0.03, 50=0.0104, 100=0.0079, 250=0.00584, 500=0.00432, 1000=0.00288 (USD); Composition: Thick Film; Features: -; Size / Dimension: 0.063" L x 0.031" W (1.60mm x 0.80mm); Height: 0.018" (0.45mm); Lead Style: Surface Mount (SMD - SMT); Packaging: Cut Tape (CT); Package / Case: 0603 (1608 Metric); ComponentLink1URL: http://industrial.panasonic.com/www-cgi/jvcr13pz.cgi?E+PZ+3+AOA0001+ERJ3GEY0R00V+7+WW; ComponentLink1Description: http://industrial.panasonic.com/www-cgi/jvcr13pz.cgi?E+PZ+3+AOA0001+ERJ3GEY0R00V+7+WW; Supplier Part Number 1: P0.0GCT-ND
U1#1 = XC6SLX9-3TQG144C: as U8#2 on sheet LOGIC_FPGA; Supplier 1: Digi-Key; Supplier Part Number 1: 122-1747-ND; Manufacturer Part Number: XC6SLX9-3TQG144C; RoHS: RoHS Compliant; Category: Integrated Circuits (ICs); Stock 1: 77; Pricing 1: 1=17.22 (USD); Number of Gates: -; Mounting Type: Surface Mount; Operating Temperature: 0°C ~ 85°C; Package / Case: 144-LQFP; Supplier Device Package: 144-TQFP (20x20); ComponentLink1URL: http://www.xilinx.com/support/documentation/data_sheets/ds160.pdf; ComponentLink1Description: http://www.xilinx.com/support/documentation/data_sheets/ds160.pdf; Value: XC6SLX9-3TQG144C
U2 = M25PE40-VMN6TP: IC FLASH 4MBIT 75MHZ 8SOIC; Manufacturer: Numonyx - A DIVISION OF MICRON SEMICONDUCTOR PRODUCTS, INC.; Memory Size: 4M (512K x 8); Interface: SPI, 3-Wire Serial; Voltage - Supply: 2.7 V ~ 3.6 V; Supplier 1: Digi-Key; Supplier Part Number 1: M25PE40-VMN6TPCT-ND; Manufacturer Part Number: M25PE40-VMN6TP; RoHS: RoHS Compliant; Category: Integrated Circuits (ICs); Pricing 1: 1=1.86, 10=1.666, 25=1.47, 100=1.323, 250=1.15152, 500=1.029, 1000=0.8085 (USD); Format - Memory: FLASH; Memory Type: FLASH; Speed: 75MHz; Operating Temperature: -40°C ~ 85°C; Package / Case: 8-SOIC (0.154", 3.90mm Width); Supplier Device Package: 8-SO; Packaging: Cut Tape (CT); ComponentLink1URL: http://media.digikey.com/pdf/Data%20Sheets/Micron%20Technology%20Inc%20PDFs/M25PE40.pdf; ComponentLink1Description: http://media.digikey.com/pdf/Data%20Sheets/Micron%20Technology%20Inc%20PDFs/M25PE40.pdf; Stock 1: 1941; Value: M25PE40-VMN6TP
U7 = OSC - ASDMB-50.000MHZ-LC-T: OSC MEMS 50.000 MHZ SMD; Manufacturer: Abracon Corporation; Frequency: 50MHz; Function: Tri-State (Output Enable); Output: CMOS; Voltage - Supply: 1.8 V ~ 3.3 V; Frequency Stability: ±50ppm; Current - Supply (Max): 16mA; Current - Supply (Disable) (Max): 15µA; Supplier 1: Digi-Key; Manufacturer Part Number: ASDMB-50.000MHZ-LC-T; RoHS: RoHS Compliant; Category: Crystals and Oscillators; Stock 1: 967; Pricing 1: 1=1.69, 10=1.463, 50=1.2826, 100=1.0125, 500=0.855 (USD); Type: MEMS (Silicon); Operating Temperature: -40°C ~ 85°C; Mounting Type: Surface Mount; Size / Dimension: 0.098" L x 0.079" W (2.50mm x 2.00mm); Height: 0.035" (0.90mm); Package / Case: 4-SMD, No Lead (DFN, LCC); Packaging: Cut Tape (CT); ComponentLink1URL: http://www.abracon.com/Oscillators/ASDMB.pdf; ComponentLink1Description: http://www.abracon.com/Oscillators/ASDMB.pdf; Supplier Part Number 1: 535-11738-1-ND; Value: OSC - 50Mhz

## Sheet DIGITAL_IO.SchDoc: Peripherals
size B; Author: Michael Jones; Engineer: Michael Jones; Organization: Group VIII Technology; Address1: 1652 W 820 N; Address2: Provo; Address3: UT  84601; Address4: 801-379-0118; DocumentNumber: 5; Revision: A3; SheetNumber: 4; SheetTotal: 7
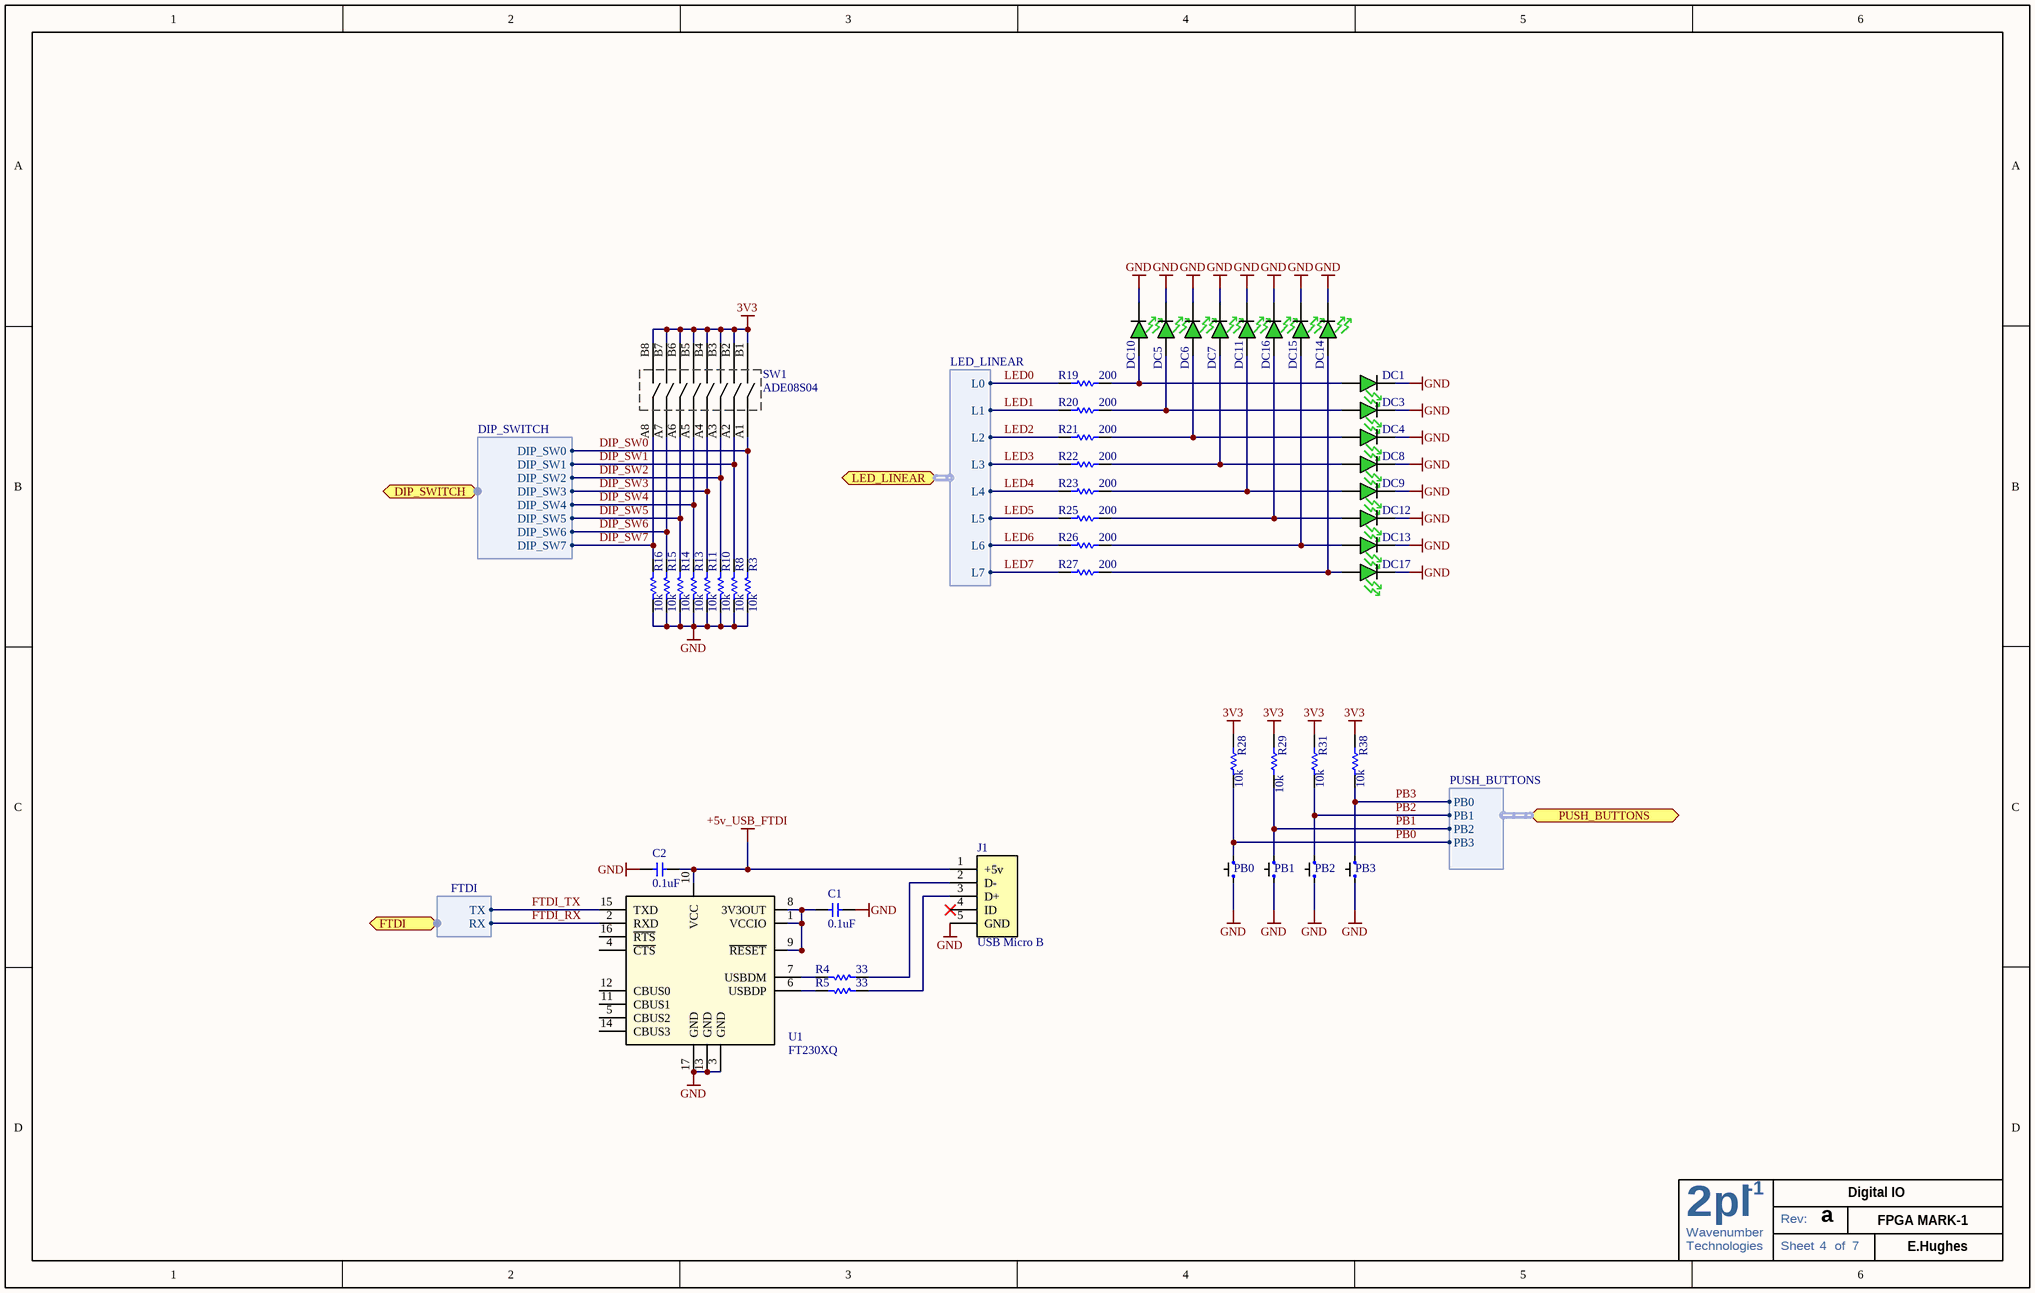
[diagram p3: DIGITAL_IO.SchDoc]

### Parts
(Parts that share a designator on the sheet are numbered #1, #2 ... from top to bottom, then left to right.)
C1#2  0.1uF  [C0603]
C2#2  0.1uF  [C0603]
DC1  LED 1.6X0.8MM 570NM GRN CLR SMD  [LED_0603 - GREEN]  (value not drawn)
DC3  LED 1.6X0.8MM 570NM GRN CLR SMD  [LED_0603 - GREEN]  (value not drawn)
DC4  LED 1.6X0.8MM 570NM GRN CLR SMD  [LED_0603 - GREEN]  (value not drawn)
DC5  LED 1.6X0.8MM 570NM GRN CLR SMD  [LED_0603 - GREEN]  (value not drawn)
DC6  LED 1.6X0.8MM 570NM GRN CLR SMD  [LED_0603 - GREEN]  (value not drawn)
DC7  LED 1.6X0.8MM 570NM GRN CLR SMD  [LED_0603 - GREEN]  (value not drawn)
DC8  LED 1.6X0.8MM 570NM GRN CLR SMD  [LED_0603 - GREEN]  (value not drawn)
DC9  LED 1.6X0.8MM 570NM GRN CLR SMD  [LED_0603 - GREEN]  (value not drawn)
DC10  LED 1.6X0.8MM 570NM GRN CLR SMD  [LED_0603 - GREEN]  (value not drawn)
DC11  LED 1.6X0.8MM 570NM GRN CLR SMD  [LED_0603 - GREEN]  (value not drawn)
DC12  LED 1.6X0.8MM 570NM GRN CLR SMD  [LED_0603 - GREEN]  (value not drawn)
DC13  LED 1.6X0.8MM 570NM GRN CLR SMD  [LED_0603 - GREEN]  (value not drawn)
DC14  LED 1.6X0.8MM 570NM GRN CLR SMD  [LED_0603 - GREEN]  (value not drawn)
DC15  LED 1.6X0.8MM 570NM GRN CLR SMD  [LED_0603 - GREEN]  (value not drawn)
DC16  LED 1.6X0.8MM 570NM GRN CLR SMD  [LED_0603 - GREEN]  (value not drawn)
DC17  LED 1.6X0.8MM 570NM GRN CLR SMD  [LED_0603 - GREEN]  (value not drawn)
J1  USB Micro B  [10103594-0001LF - Testing Smaller Thru]
PB0  FSM4JSMA  [FSM4JSMA]  (value not drawn)
PB1  FSM4JSMA  [FSM4JSMA]  (value not drawn)
PB2  FSM4JSMA  [FSM4JSMA]  (value not drawn)
PB3  FSM4JSMA  [FSM4JSMA]  (value not drawn)
R3#2  10k  [R0603]
R4#2  33  [R0603]
R5#2  33  [R0603]
R8#2  10k  [R0603]
R10  10k  [R0603]
R11  10k  [R0603]
R13#2  10k  [R0603]
R14  10k  [R0603]
R15  10k  [R0603]
R16  10k  [R0603]
R19  200  [R0603]
R20  200  [R0603]
R21  200  [R0603]
R22  200  [R0603]
R23  200  [R0603]
R25  200  [R0603]
R26  200  [R0603]
R27  200  [R0603]
R28  10k  [R0603]
R29  10k  [R0603]
R31  10k  [R0603]
R38  10k  [R0603]
SW1  ADE08S04  [ADE08S04]
U1#2  FT230XQ  [FT230x-QFN65P400X400X80-16L]

### Ports
DIP_SWITCH (harness DIP_SWITCH), FTDI (harness FTDI), LED_LINEAR (harness LED_LINEAR), PUSH_BUTTONS (harness PUSH_BUTTONS)

### Harnesses
DIP_SWITCH: DIP_SW0, DIP_SW1, DIP_SW2, DIP_SW3, DIP_SW4, DIP_SW5, DIP_SW6, DIP_SW7
PUSH_BUTTONS: PB0, PB1, PB2, PB3
LED_LINEAR: L0, L1, L2, L3, L4, L5, L6, L7
FTDI: TX, RX

### Nets
3V3: R28.2 R29.2 R31.2 R38.2 SW1.B1 SW1.B2 SW1.B3 SW1.B4 SW1.B5 SW1.B6 SW1.B7 SW1.B8
+5v_USB_FTDI: C2#2.2 J1.1(+5v) U1#2.10(VCC)
GND: C1#2.1 C2#2.1 DC1.C DC3.C DC4.C DC5.C DC6.C DC7.C DC8.C DC9.C DC10.C DC11.C DC12.C DC13.C DC14.C DC15.C DC16.C DC17.C J1.5(GND) PB0.A PB1.A PB2.A PB3.A R3#2.1 R8#2.1 R10.1 R11.1 R13#2.1 R14.1 R15.1 R16.1 U1#2.3(GND) U1#2.13(GND) U1#2.17(GND)
DIP_SW0: R3#2.2 SW1.A1 ; port DIP_SWITCH.DIP_SW0
DIP_SW1: R8#2.2 SW1.A2 ; port DIP_SWITCH.DIP_SW1
DIP_SW2: R10.2 SW1.A3 ; port DIP_SWITCH.DIP_SW2
DIP_SW3: R11.2 SW1.A4 ; port DIP_SWITCH.DIP_SW3
DIP_SW4: R13#2.2 SW1.A5 ; port DIP_SWITCH.DIP_SW4
DIP_SW5: R14.2 SW1.A6 ; port DIP_SWITCH.DIP_SW5
DIP_SW6: R15.2 SW1.A7 ; port DIP_SWITCH.DIP_SW6
DIP_SW7: R16.2 SW1.A8 ; port DIP_SWITCH.DIP_SW7
FTDI_RX: U1#2.2(RXD) ; port FTDI.RX
FTDI_TX: U1#2.15(TXD) ; port FTDI.TX
LED0: R19.2 ; port LED_LINEAR.L0
LED1: R20.2 ; port LED_LINEAR.L1
LED2: R21.2 ; port LED_LINEAR.L2
LED3: R22.2 ; port LED_LINEAR.L3
LED4: R23.2 ; port LED_LINEAR.L4
LED5: R25.2 ; port LED_LINEAR.L5
LED6: R26.2 ; port LED_LINEAR.L6
LED7: R27.2 ; port LED_LINEAR.L7
PB0: PB0.B R28.1 ; port PUSH_BUTTONS.PB3
PB1: PB1.B R29.1 ; port PUSH_BUTTONS.PB2
PB2: PB2.B R31.1 ; port PUSH_BUTTONS.PB1
PB3: PB3.B R38.1 ; port PUSH_BUTTONS.PB0
NetC1#2_2: C1#2.2 U1#2.1(VCCIO) U1#2.8(3V3OUT) U1#2.9(~{RESET})
NetDC1_A: DC1.A DC10.A R19.1
NetDC3_A: DC3.A DC5.A R20.1
NetDC4_A: DC4.A DC6.A R21.1
NetDC7_A: DC7.A DC8.A R22.1
NetDC9_A: DC9.A DC11.A R23.1
NetDC12_A: DC12.A DC16.A R25.1
NetDC13_A: DC13.A DC15.A R26.1
NetDC14_A: DC14.A DC17.A R27.1
NetJ1_2: J1.2(D-) R4#2.1
NetJ1_3: J1.3(D+) R5#2.1
NetR4#2_2: R4#2.2 U1#2.7(USBDM)
NetR5#2_2: R5#2.2 U1#2.6(USBDP)

Not connected (* = marked no-connect by the designer): J1 4(ID)*; U1#2 4(~{CTS}) 5(CBUS2) 11(CBUS1) 12(CBUS0) 14(CBUS3) 16(~{RTS})

### Notes on the sheet
- a
- Digital IO
- FPGA MARK-1
- E.Hughes
- 2
- Wavenumber
- pl
- -1
- Rev:
- Technologies
- Sheet
- of

### Library data of the parts
C1#2 C2#2 = GRM188R71H104KA93D: as C43#1 on sheet POWER_SUPPLY; Value: 0.1uF; Supplier 1: Digi-Key; Supplier Part Number 1: 490-1519-1-ND; Manufacturer Part Number: GRM188R71H104KA93D; RoHS: RoHS Compliant; Category: Capacitors; Stock 1: 6315460; Pricing 1: 10=0.037, 100=0.0221, 500=0.01276, 1000=0.00884 (USD); Voltage - Rated: 50V; Tolerance: ±10%; Temperature Coefficient: X7R; Mounting Type: Surface Mount, MLCC; Operating Temperature: -55°C ~ 125°C; Features: -; Applications: General Purpose; Ratings: -; Package / Case: 0603 (1608 Metric); Size / Dimension: 0.063" L x 0.031" W (1.60mm x 0.80mm); Lead Spacing: -; Thickness: 0.80mm; Packaging: Cut Tape (CT); Lead Style: -; ComponentLink1URL: http://search.murata.co.jp/Ceramy/image/img/PDF/ENG/GRM188R71H104KA93.pdf; ComponentLink1Description: http://search.murata.co.jp/Ceramy/image/img/PDF/ENG/GRM188R71H104KA93.pdf
DC1 DC3-DC17 = APT1608CGCK: Manufacturer: Kingbright Corp; Current - Test: 20mA; Wavelength - Peak: 574nm; Millicandela Rating: 50mcd; Voltage - Forward (Vf) Typ: 2.1V; Lens Type: Clear; Lens Style/Size: Rectangle, 1.2mm x 0.8mm; Viewing Angle: 120°; Value: LED 1.6X0.8MM 570NM GRN CLR SMD; Supplier 1: Digi-Key; Supplier Part Number 1: 754-1116-2-ND; Manufacturer Part Number: APT1608CGCK; RoHS: RoHS Compliant; Description: LED 1.6X0.8MM 570NM GRN CLR SMD; Category: Optoelectronics; Stock 1: 94000; Pricing 1: 2000=0.051, 6000=0.045, 10000=0.043 (USD); Color: Green; Luminous Flux @ Current - Test: -; Wavelength - Dominant: 570nm; Size / Dimension: 1.60mm L x 0.80mm W; Height: 0.75mm; Package / Case: 0603 (1608 Metric); Mounting Type: Surface Mount; Packaging: Tape & Reel (TR); ComponentLink1URL: http://www.us.kingbright.com/images/catalog/SPEC/APT1608CGCK.pdf; ComponentLink1Description: http://www.us.kingbright.com/images/catalog/SPEC/APT1608CGCK.pdf
J1 = 10103594-0001LF - USB Micro: CONN RCPT STD MICRO USB TYPE B; Manufacturer: FCI; Connector Type: USB - micro B; Number of Contacts: 5; Gender: Receptacle; Specifications: USB 2.0; Micro USB B: Value; Notes: Similar to; Supplier 1: Digi-Key; Manufacturer Part Number: 10103594-0001LF; RoHS: RoHS Compliant; Category: Connectors, Interconnects; Stock 1: 23288; Pricing 1: 1=1.1, 10=0.768, 100=0.517, 250=0.43912, 500=0.41716 (USD); Mounting Type: Surface Mount, Right Angle, Horizontal; Features: Shielded, Solder Retention; Packaging: Cut Tape (CT); Ingress Protection: -; ComponentLink1URL: http://portal.fciconnect.com/res/en/pdffiles/doc_search/10103594.pdf; ComponentLink1Description: http://portal.fciconnect.com/res/en/pdffiles/doc_search/10103594.pdf; Supplier Part Number 1: 609-4050-1-ND; Value: USB Micro B
PB0-PB3 = FSM4JSMATR: SWITCH TACTILE SPST-NO 0.05A 12V; Manufacturer: TE Connectivity; Switch Function: Off-Mom; Contact Rating @ Voltage: 0.05A @ 12VDC; Actuator Type: Standard; Outline: 6.00mm x 6.00mm; Illumination: Non-Illuminated; Operating Force: 160gf; Supplier 1: Digi-Key; Supplier Part Number 1: 450-1759-2-ND; Manufacturer Part Number: FSM4JSMATR; RoHS: RoHS Compliant; Category: Switches; Stock 1: 40800; Pricing 1: 1200=0.154, 2400=0.141, 6000=0.132, 8400=0.123, 12000=0.119, 30000=0.117, 60000=0.115 (USD); Circuit: SPST-NO; Mounting Type: Surface Mount; Termination Style: Gull Wing; Orientation: Vertical; Packaging: Tape & Reel (TR); ComponentLink1URL: http://documents.tycoelectronics.com/commerce/DocumentDelivery/DDEController?Action=srchrtrv&DocNm=2-1437565-7&DocType=CD&DocLang=EN; ComponentLink1Description: http://documents.tycoelectronics.com/commerce/DocumentDelivery/DDEController?Action=srchrtrv&DocNm=2-1437565-7&DocType=CD&DocLang=EN; Value: FSM4JSMA
R3#2 R8#2 R10 R11 R13#2 R14-R16 R28 R29 R31 R38 = ERJ-3EKF1002V: as R1#1 on sheet FPGA_POWER_AND_CONFIGURATION; Manufacturer Part Number: ERJ-3EKF1002V; Value: 10k; Supplier 1: Digi-Key; RoHS: RoHS Compliant; Category: Resistors; Stock 1: 11168880; Pricing 1: 1=0.04, 50=0.015, 100=0.0114, 250=0.00844, 500=0.00624, 1000=0.00416 (USD); Resistance (Ohms): 10.0K; Composition: Thick Film; Features: -; Tolerance: ±1%; Size / Dimension: 0.063" L x 0.031" W (1.60mm x 0.80mm); Height: 0.018" (0.45mm); Lead Style: Surface Mount (SMD - SMT); Packaging: Cut Tape (CT); Package / Case: 0603 (1608 Metric); ComponentLink1URL: http://industrial.panasonic.com/www-cgi/jvcr13pz.cgi?E+PZ+3+AOA0002+ERJ3EKF1002V+7+WW; ComponentLink1Description: http://industrial.panasonic.com/www-cgi/jvcr13pz.cgi?E+PZ+3+AOA0002+ERJ3EKF1002V+7+WW; Supplier Part Number 1: P10.0KHCT-ND
R4#2 R5#2 = ERJ-3EKF33R0V: RES 33.0 OHM 1/10W 1% 0603 SMD; Manufacturer: Panasonic - ECG; Power (Watts): 0.1W, 1/10W; Temperature Coefficient: ±100ppm/°C; Value: 33; Supplier 1: Digi-Key; Manufacturer Part Number: ERJ-3EKF33R0V; RoHS: RoHS Compliant; Category: Resistors; Stock 1: 1263163; Pricing 1: 1=0.04, 50=0.0138, 100=0.0105, 250=0.0078, 500=0.00576, 1000=0.00384 (USD); Resistance (Ohms): 33; Composition: Thick Film; Features: -; Tolerance: ±1%; Size / Dimension: 0.063" L x 0.031" W (1.60mm x 0.80mm); Height: 0.018" (0.45mm); Number of Terminations: 2; Packaging: Cut Tape (CT); Package / Case: 0603 (1608 Metric); ComponentLink1URL: http://industrial.panasonic.com/www-cgi/jvcr13pz.cgi?E+PZ+3+AOA0002+ERJ3EKF33R0V+7+WW; ComponentLink1Description: http://industrial.panasonic.com/www-cgi/jvcr13pz.cgi?E+PZ+3+AOA0002+ERJ3EKF33R0V+7+WW; Supplier Part Number 1: P33.0HCT-ND
R19-R23 R25-R27 = ERJ-3EKF2000V: as R37 on sheet LOGIC_FPGA; Manufacturer Part Number: ERJ-3EKF2000V; Value: RES 200 OHM 1/10W 1% 0603 SMD; Supplier 1: Digi-Key; Supplier Part Number 1: P200HCT-ND; RoHS: RoHS Compliant; Category: Resistors; Stock 1: 1279595; Pricing 1: 1=0.04, 50=0.015, 100=0.0114, 250=0.00844, 500=0.00624, 1000=0.00416 (USD); Resistance (Ohms): 200; Composition: Thick Film; Features: -; Tolerance: ±1%; Size / Dimension: 0.063" L x 0.031" W (1.60mm x 0.80mm); Height: 0.018" (0.45mm); Lead Style: Surface Mount (SMD - SMT); Packaging: Cut Tape (CT); Package / Case: 0603 (1608 Metric); ComponentLink1URL: http://industrial.panasonic.com/www-cgi/jvcr13pz.cgi?E+PZ+3+AOA0002+ERJ3EKF2000V+7+WW; ComponentLink1Description: http://industrial.panasonic.com/www-cgi/jvcr13pz.cgi?E+PZ+3+AOA0002+ERJ3EKF2000V+7+WW
SW1 = ADE08S04: SWITCH DIP SPST EXT ACT 8POS SMD; Manufacturer: TE Connectivity; Number of Positions: 8; Contact Rating @ Voltage: 0.4VA @ 20VAC/DC; Actuator Type: Standard; Actuator Level: Raised; Washable: Yes; Supplier 1: Digi-Key; Supplier Part Number 1: 1-1825058-9-ND; Manufacturer Part Number: ADE08S04; RoHS: RoHS Compliant; Category: Switches; Stock 1: 28135; Pricing 1: 1=1, 10=0.879, 50=0.7926, 100=0.7581, 250=0.68916, 500=0.62024, 1000=0.55133, 5000=0.48241, 10000=0.45829 (USD); Circuit: SPST; Mounting Type: Surface Mount; Orientation: Top Actuated; ComponentLink1URL: http://documents.tycoelectronics.com/commerce/DocumentDelivery/DDEController?Action=srchrtrv&DocNm=1825058&DocType=CD&DocLang=EN; ComponentLink1Description: http://documents.tycoelectronics.com/commerce/DocumentDelivery/DDEController?Action=srchrtrv&DocNm=1825058&DocType=CD&DocLang=EN; Value: ADE08S04
U1#2 = FT230XQ-R: IC USB SERIAL BASIC UART QFN-16; Manufacturer: FTDI, Future Technology Devices International Ltd; Number of Channels: 1, UART; FIFO's: 512 Byte; Protocol: RS-232, RS-422, RS-485; Voltage - Supply: 3.3 V ~ 5 V; With Auto Flow Control: Yes; With Modem Control: No; Supplier 1: Digi-Key; Manufacturer Part Number: FT230XQ-R; RoHS: RoHS Compliant; Category: Integrated Circuits (ICs); Stock 1: 4560; Pricing 1: 1=2.3, 10=2.07, 25=1.9552, 50=1.84, 100=1.725, 250=1.61, 500=1.5525, 1000=1.5295 (USD); Features: USB to UART with Battery Detection; With Parallel Port: *; With IrDA Encoder/Decoder: *; With False Start Bit Detection: *; With CMOS: Yes; Mounting Type: Surface Mount; Package / Case: 16-VQFN Exposed Pad; Supplier Device Package: 16-QFN-EP (4x4); Packaging: Cut Tape (CT); ComponentLink1URL: http://www.ftdichip.com/Support/Documents/DataSheets/ICs/DS_FT230X.pdf; ComponentLink1Description: http://www.ftdichip.com/Support/Documents/DataSheets/ICs/DS_FT230X.pdf; Value: FT230XQ